# Altium schematic sheet etapa6.SchDoc
size Letter
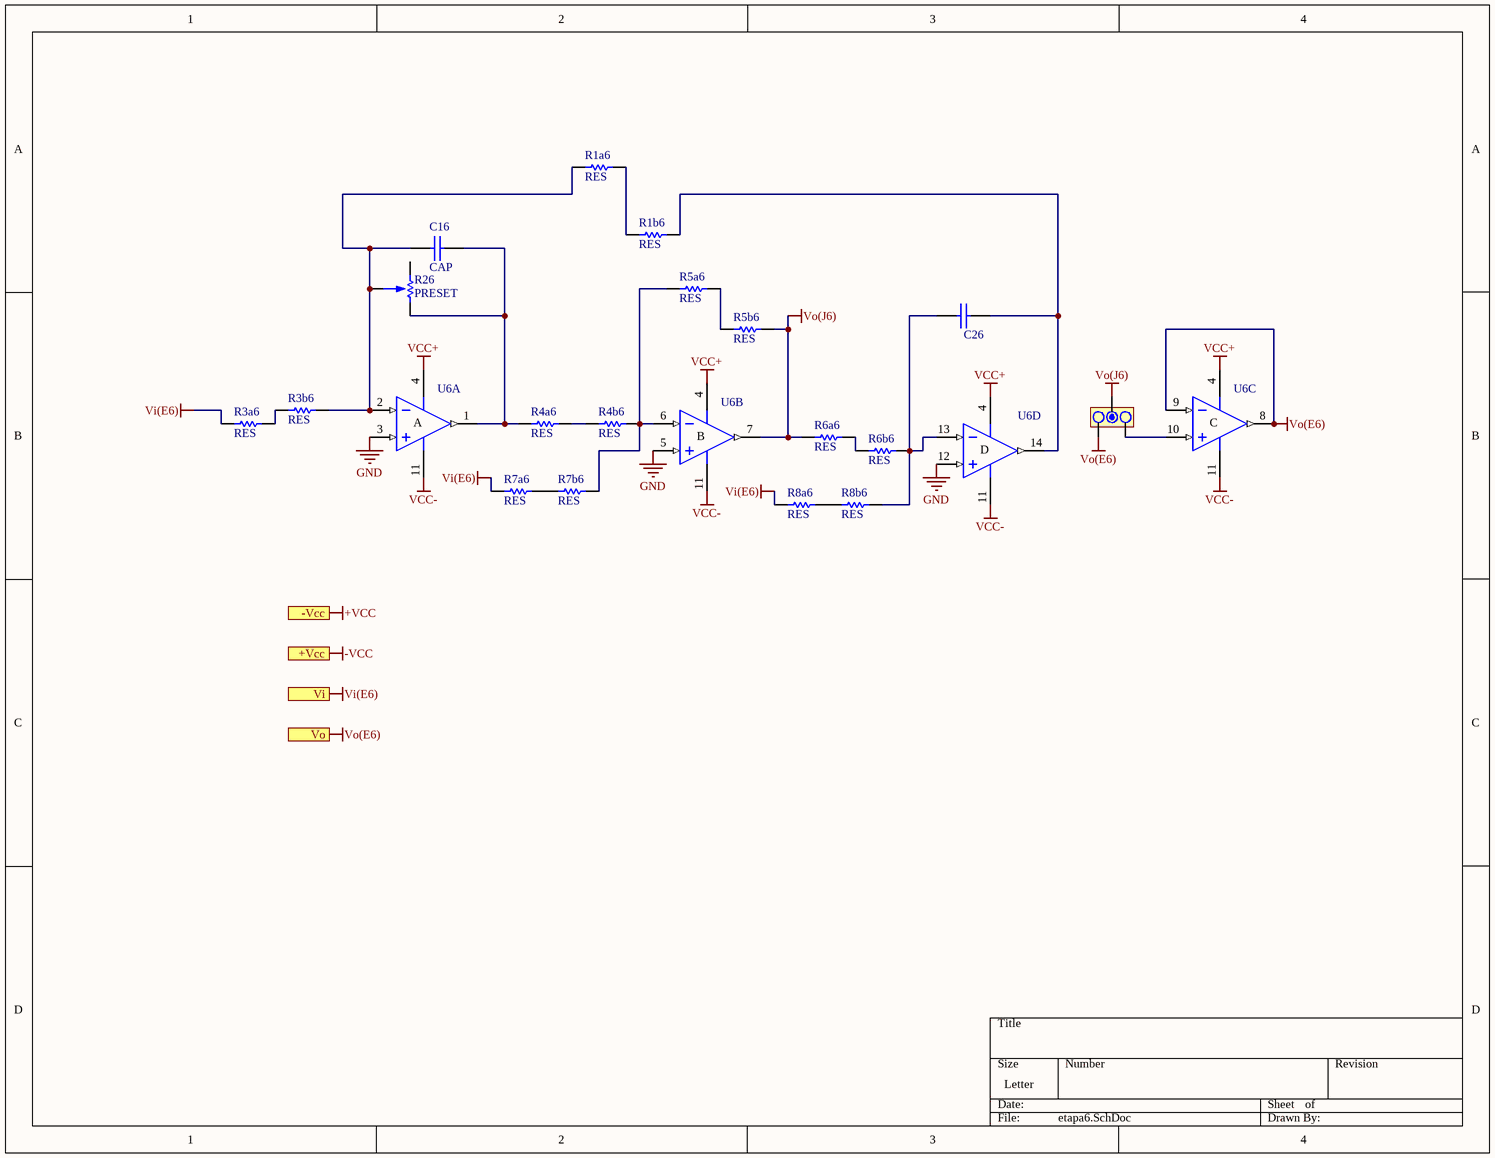
[diagram p0: etapa6.SchDoc]

## Parts
C16  CAP  [CAP200]
C26  CAP  [CAP200]  (value not drawn)
Jumper6  JUMPER  [JUMPER3]  (value not drawn)
R1a6  RES  [0805]
R1b6  RES  [0805]
R3a6  RES  [0805]
R3b6  RES  [0805]
R4a6  RES  [0805]
R4b6  RES  [0805]
R5a6  RES  [0805]
R5b6  RES  [0805]
R6a6  RES  [0805]
R6b6  RES  [0805]
R7a6  RES  [0805]
R7b6  RES  [0805]
R8a6  RES  [0805]
R8b6  RES  [0805]
R26  PRESET  [PRESET V]
U6  TL084N  [N014]  (value not drawn)  (parts A,B,C,D of 4)

## Ports
+Vcc, -Vcc, Vi, Vo

## Nets
+VCC: port -Vcc
-VCC: port +Vcc
GND: U6.3(IN+) U6.5(IN+) U6.12(IN+)
VCC+: U6.4(V+)
VCC-: U6.11(V-)
Vi(E6): R3a6.1 R7a6.1 R8a6.1 ; port Vi
Vo(E6): Jumper6.3 U6.8(OUT) U6.9(IN-) ; port Vo
Vo(J6): Jumper6.2 R5b6.2 R6a6.1 U6.7(OUT)
NetC16_1: C16.1 R1a6.1 R3b6.2 R26.2 U6.2(IN-)
NetC16_2: C16.2 R4a6.1 R26.1 U6.1(OUT)
NetC26_1: C26.1 R6b6.2 R8b6.2 U6.13(IN-)
NetC26_2: C26.2 R1b6.2 U6.14(OUT)
NetJumper6_1: Jumper6.1 U6.10(IN+)
NetR1a6_2: R1a6.2 R1b6.1
NetR3a6_2: R3a6.2 R3b6.1
NetR4a6_2: R4a6.2 R4b6.1
NetR4b6_2: R4b6.2 R5a6.1 R7b6.2 U6.6(IN-)
NetR5a6_2: R5a6.2 R5b6.1
NetR6a6_2: R6a6.2 R6b6.1
NetR7a6_2: R7a6.2 R7b6.1
NetR8a6_2: R8a6.2 R8b6.1

Not connected (* = marked no-connect by the designer): R26 3

## Notes on the sheet
- (in symbol TL084N, part A) A
- (in symbol TL084N, part B) B
- (in symbol TL084N, part C) C
- (in symbol TL084N, part D) D

## Library data of the parts
Jumper6 = JUMPER3
U6 = TL084N: JFET-Input Operational Amplifier; Published: 16-Jan-2001; LatestRevisionDate: 04-Mar-2005; LatestRevisionNote: Stylized 3D Model Added.; DatasheetVersion: Feb-1999; PackageVersion: Oct-1995; PackageReference: N014; Publisher: Altium Limited; PackageDescription: DIP; 14 Leads; Row Spacing 7.62 mm; Pitch 2.54 mm; ComponentLink1Description: Manufacturer Link; ComponentLink1URL: http://www.ti.com/; ComponentLink2Description: Datasheet; ComponentLink2URL: http://www-s.ti.com/sc/ds/tl084.pdf